# Altium schematic sheet P08_Power Supply Track.SchDoc
size A; SheetNumber: 7; SheetTotal: 8
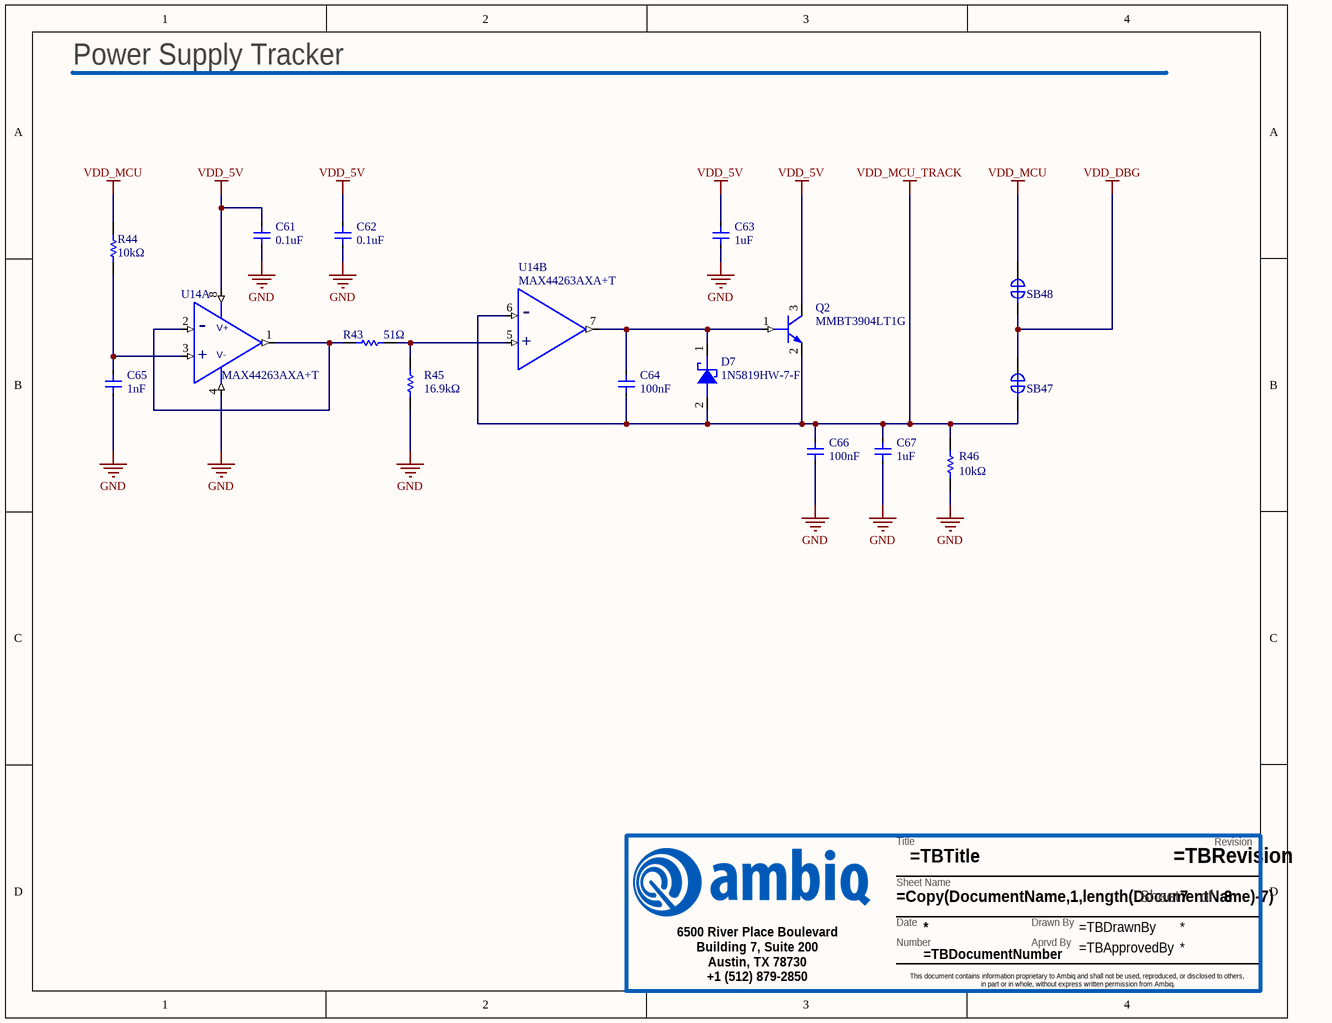
[diagram p0: P08_Power Supply Track.SchDoc]

## Parts
?  TitleBlock  (value not drawn)  (graphical)
C61  0.1uF  [IPC_C]
C62  0.1uF  [IPC_C]
C63  1uF  [IPC_A]
C64  100nF  [IPC_A]
C65  1nF  [IPC_A]
C66  100nF  [IPC_A]
C67  1uF  [IPC_A]
D7  AMBIQ PN: 1N5819HW-7-F  [SOD123_112X67]  (hidden comment: Schottky)
Q2  MMBT3904LT1G  [SOT23-3N]
R43  51Ω  [IPC_A]
R44  10kΩ  [IPC_A]
R45  16.9kΩ  [IPC_A]
R46  10kΩ  [IPC_A]
SB47  Solder short  [SB39X18_SHORTED]  (value not drawn)  (net tie, no BOM)
SB48  Solderbridge  [SB39X18]  (value not drawn)  (no BOM)
U14  MAX44263AXA+T  [SC70_8_2X2MM]  (parts A,B of 2)

## Nets
GND: C61.2 C62.2 C63.2 C65.2 C66.2 C67.2 R45.1 R46.1 U14.4(VSS)
VDD_5V: C61.1 C62.1 C63.1 Q2.3(COLLECTOR) U14.8(VDD)
VDD_DBG: SB47.2 SB48.1
VDD_MCU: R44.1 SB48.2
VDD_MCU_TRACK: C64.2 C66.1 C67.1 D7.2(A) Q2.2(EMITTER) R46.2 SB47.1 U14.6(INB-)
NetC64_1: C64.1 D7.1(C) Q2.1(BASE) U14.7(OUTB)
NetC65_1: C65.1 R44.2 U14.3(INB+)
NetR43_1: R43.1 U14.1(OUTB) U14.2(INB-)
NetR43_2: R43.2 R45.2 U14.5(INB+)

## Notes on the sheet
- Power Supply Tracker
- (in symbol MAX44263AXA+T, part A) V+; +; V-
- (in symbol MAX44263AXA+T, part B) +
- (in symbol TitleBlock) Revision; Title; Sheet Name; Sheet; of; Date; Drawn By; Number; Aprvd By; 6500 River Place Boulevard / Building 7, Suite 200 / Austin, TX 78730 / +1 (512) 879-2850; This document contains information proprietary to Ambiq and shall not be used, reproduced, or disclosed to others, / in part or in whole, without express written permission from Ambiq.

## Library data of the parts
? = TitleBlock: Title block for Ambiq Schematics. Please have the following parameters entered in Project>Project Options>Parameters: / TBTitle / TBDocumentNumber / TBRevision / TBDrawnBy / TBApprovedBy; AMBIQ PN: TitleBlock; DESCRIPTION: Title block for Ambiq Schematics. Please have the following parameters entered in Project>Project Options>Parameters:  TBTitle  TBDocumentNumber  TBRevision  TBDrawnBy  TBApprovedBy
C61 C62 = GRM155R71C104KA88D: NONE; Manufacturer: Murata; Capacitance: 100nF; Tolerance: 10%; Voltage Rating: 16V; Dielectric: X7R; Dielectric Material: Ceramic; Insulation Resistance: 10GR; AMBIQ PN: GRM155R71C104KA88D; Supplier 1: Arrow Electronics; Supplier Part Number 1: GRM155R71C104KA88D; Manufacturer Part Number: GRM155R71C104KA88D; RoHS: Yes; Category: Ceramic Capacitors; Stock 1: 20200000; Pricing 1: 10000=0.00270, 30000=0.00220, 250000=0.00210 (USD); Mount: Surface Mount; Case/Package: 0402; Case Code (Metric): 1005; Case Code (Imperial): 0402; Min Operating Temperature: -55°C; Max Operating Temperature: 125°C; Packaging: Tape and Reel; Voltage: 16V; Voltage Rating (DC): 16V; Length: 1mm; Width: 0.5mm; Height: 0.5mm; Thickness: 0.022inch; Depth: 0.5mm; Radiation Hardening: No; REACH SVHC: No SVHC; Lead Free: Lead Free; RoHS Compliant: Yes; ComponentLink1URL: https://datasheet.ciiva.com/129/grm155r71c104ka88-01-129739.pdf?src-supplier=Digi-Key; ComponentLink1Description: https://datasheet.ciiva.com/129/grm155r71c104ka88-01-129739.pdf?src-supplier=Digi-Key; Package Quantity: 1; Termination: SMD/SMT; Number of Pins: 2; Material: Ceramic; ComponentLink2URL: https://datasheet.ciiva.com/129/grm155r71c104ka88-01-129740.pdf?src-supplier=Digi-Key; ComponentLink2Description: https://datasheet.ciiva.com/129/grm155r71c104ka88-01-129740.pdf?src-supplier=Digi-Key; ComponentLink3URL: https://datasheet.ciiva.com/18102/getdatasheetpartid-85307-18102905.pdf?src-supplier=Verical; ComponentLink3Description: https://datasheet.ciiva.com/18102/getdatasheetpartid-85307-18102905.pdf?src-supplier=Verical
C63 C67 = GRM033R61A105ME15D: NONE; Manufacturer: Murata; Tolerance: 20%; Voltage Rating: 10V; Dielectric: X5R; AMBIQ PN: GRM033R61A105ME15D; Supplier 1: Arrow Electronics; Supplier Part Number 1: GRM033R61A105ME15D; Manufacturer Part Number: GRM033R61A105ME15D; RoHS: Yes; Category: Ceramic Capacitors; Stock 1: 387591; Pricing 1: 1=0.35440, 10=0.26860, 25=0.26600, 50=0.24050, 100=0.18220, 250=0.18020, 500=0.17800, 1000=0.12040, 3000=0.11920, 6000=0.08160,; Mount: Surface Mount; Case/Package: 0201; Case Code (Metric): 0603; Case Code (Imperial): 0201; Min Operating Temperature: -55°C; Max Operating Temperature: 85°C; Capacitance: 1uF; Packaging: Tape and Reel; Voltage Rating (DC): 10V; Length: 0.024inch; Width: 0.012inch; Thickness: 0.015inch; RoHS Compliant: Yes; ComponentLink1URL: http://search.murata.co.jp/Ceramy/image/img/A01X/G101/ENG/GRM033R61A105ME15-01.pdf?src-supplier=Digi-Key; ComponentLink1Description: http://search.murata.co.jp/Ceramy/image/img/A01X/G101/ENG/GRM033R61A105ME15-01.pdf?src-supplier=Digi-Key
C64 C66 = 0201ZD104KAT2A: NONE; Manufacturer: Kyocera AVX; Tolerance: 10%; Voltage Rating: 10V; AMBIQ PN: 0201ZD104KAT2A; Supplier 1: Arrow Electronics; Supplier Part Number 1: 0201ZD104KAT2A; Manufacturer Part Number: 0201ZD104KAT2A; RoHS: Yes; Category: Ceramic Capacitors; Stock 1: 105000; Pricing 1: 15000=0.00770, 30000=0.00750, 45000=0.00740, 60000=0.00720, 75000=0.00690, 150000=0.00620 (USD); Mount: Surface Mount; Case/Package: 0201; Case Code (Metric): 0603; Case Code (Imperial): 0201; Min Operating Temperature: -55°C; Max Operating Temperature: 85°C; Capacitance: 100nF; Packaging: Tape and Reel; Voltage Rating (DC): 10V; Series: -; Lead Free: Lead Free; RoHS Compliant: Yes; ComponentLink1URL: http://www.mouser.com/ds/2/40/cx5r-776519.pdf?src-supplier=Mouser; ComponentLink1Description: http://www.mouser.com/ds/2/40/cx5r-776519.pdf?src-supplier=Mouser
C65 = GRM1555C1H102JA01D: NONE; Manufacturer: Murata; Tolerance: 5%; Voltage Rating: 50V; Dielectric: C0G; Dielectric Material: Ceramic; Insulation Resistance: 10GR; Temperature Coefficient: 30ppm/°C; AMBIQ PN: GRM1555C1H102JA01D; Supplier 1: Arrow Electronics; Supplier Part Number 1: GRM1555C1H102JA01D; Manufacturer Part Number: GRM1555C1H102JA01D; RoHS: Yes; Category: Ceramic Capacitors; Stock 1: 3380000; Pricing 1: 10000=0.00710, 20000=0.00680, 30000=0.00660, 50000=0.00590, 100000=0.00470 (USD); Mount: Surface Mount; Case/Package: 0402; Case Code (Metric): 1005; Case Code (Imperial): 0402; Min Operating Temperature: -55°C; Max Operating Temperature: 125°C; Capacitance: 1nF; Packaging: Tape and Reel; Voltage: 50V; Voltage Rating (DC): 50V; Series: GRM; Construction: Flat; Length: 1mm; Width: 0.5mm; Height: 0.5mm; Thickness: 0.022inch; Depth: 0.5mm; Radiation Hardening: No; REACH SVHC: No SVHC; Lead Free: Lead Free; RoHS Compliant: Yes; ComponentLink1URL: https://datasheet.ciiva.com/34302/1855908-34302849.pdf?src-supplier=Jameco; ComponentLink1Description: https://datasheet.ciiva.com/34302/1855908-34302849.pdf?src-supplier=Jameco; Package Quantity: 1; Termination: SMD/SMT; Number of Pins: 2; Material: Ceramic; Size: 0.5mm
D7 = 1N5819HW-7-F: None; Manufacturer: Diodes; Forward Current: 1A; Max Repetitive Reverse Voltage (Vrrm): 40V; Forward Voltage: 450mV; Max Reverse Current: 50uA; Element Configuration: Single; Max Forward Surge Current (Ifsm): 25A; Max Power Dissipation: 450mW; Polarity: Standard; Capacitance: 110pF; Supplier 1: RSComponents; Supplier Part Number 1: 7082197; Manufacturer Part Number: 1N5819HW-7-F; RoHS: Yes; Category: Schottky Diodes; Stock 1: 100; Pricing 1: 25=0.32800, 150=0.18600, 750=0.12400, 1500=0.09400 (GBP); Case/Package: SOD-123-2; Number of Pins: 2; Weight: 0.000353oz; Contact Plating: Tin,Matte; Min Operating Temperature: -65°C; Max Operating Temperature: 125°C; Packaging: Tape and Reel; Peak Non-Repetitive Surge Current: 25A; Package Quantity: 3000; Average Rectified Current: 1A; Termination: SMD/SMT; Voltage Rating (DC): 40V; Current Rating: 1A; Output Current: 1A; Max Reverse Voltage (DC): 40V; Series: -; Length: 2.85mm; Width: 1.7mm; Height: 1.25mm; Radiation Hardening: No; RoHS Compliant: Yes; REACH SVHC: No SVHC; Lead Free: Lead Free; ComponentLink1URL: https://datasheet.ciiva.com/27092/1538419-27092484.pdf?src-supplier=Jameco; ComponentLink1Description: https://datasheet.ciiva.com/27092/1538419-27092484.pdf?src-supplier=Jameco
Q2 = MMBT3904LT1G: None; Manufacturer: ON Semiconductor; Element Configuration: Single; Max Power Dissipation: 300mW; Polarity: NPN; Voltage Rating (DC): 40V; Current Rating: 200mA; Number of Elements: 1; Frequency: 300MHz; hFE Min: 100; Collector Base Voltage (VCBO): 60V; Emitter Base Voltage (VEBO): 6V; Collector Emitter Saturation Voltage: 300mV; Type: General Purpose; AMBIQ PN: MMBT3904LT1G; Supplier 1: RSComponents; Supplier Part Number 1: 5450343; Manufacturer Part Number: MMBT3904LT1G; RoHS: Yes; Category: BJTs; Stock 1: 150; Pricing 1: 50=0.12200, 100=0.09200, 250=0.09100, 500=0.09000, 1250=0.07100 (GBP); Case/Package: SOT-23-3; Number of Pins: 3; Contact Plating: Tin,Matte; Min Operating Temperature: -55°C; Max Operating Temperature: 150°C; Packaging: Tape and Reel; Package Quantity: 1; Series: -; Length: 2.9mm; Width: 1.3mm; Height: 0.94mm; Radiation Hardening: No; RoHS Compliant: Yes; REACH SVHC: No SVHC; Lead Free: Lead Free; ComponentLink1URL: https://datasheet.ciiva.com/4723/mmbt3904lt1-d-113169-4723050.pdf; ComponentLink1Description: https://datasheet.ciiva.com/4723/mmbt3904lt1-d-113169-4723050.pdf; Collector Emitter Voltage (VCEO): 40V; Max Collector Current: 200mA; Transition Frequency: 300MHz; Collector Emitter Breakdown Voltage: 40V; Max Breakdown Voltage: 40V; Power Dissipation: 300mW; Gain Bandwidth Product: 300MHz; Max Frequency: 300MHz; Collector-emitter Voltage-Max: 300mV
R43 = CRCW040251R0FKED: Res Thick Film 0402 51 Ohm 1% 1/16W ±100ppm/°C Molded SMD SMD Paper T/R; Manufacturer: Vishay; Resistance: 51R; Power Rating: 63mW; Voltage Rating: 50V; AMBIQ PN: CRCW040251R0FKED; Supplier 1: RSComponents; Supplier Part Number 1: 6789425P; Manufacturer Part Number: CRCW040251R0FKED; RoHS: Yes; Category: Chip SMD Resistors; Stock 1: 1; Pricing 1: 50=0.06300, 500=0.05800, 1000=0.05200, 2000=0.04700, 4000=0.04000 (USD); Case/Package: 0402; Weight: 2.3E-05oz; Case Code (Metric): 1005; Case Code (Imperial): 0402; Contact Plating: Tin; Size Code: 0402; Min Operating Temperature: -55°C; Max Operating Temperature: 155°C; Package Quantity: 10; Packaging: Tape and Reel; Resistor Type: Thick Film; Number of Terminations: 2; Termination: SMD/SMT; Max Power Dissipation: 63mW; Temperature Coefficient: 100ppm/°C; Voltage Rating (DC): 50V; Features: Automotive AEC-Q200; Series: CRCW; Technology: THICK FILM; Construction: Rectangular; Length: 1mm; Width: 0.5mm; Height: 0.35mm; Depth: 0.5mm; Radiation Hardening: No; REACH SVHC: Unknown; Military Standard: Not; Lead Free: Lead Free; RoHS Compliant: Yes; ComponentLink1URL: https://datasheet.ciiva.com/11811/0900766b80d98824-11811263.pdf?src-supplier=RSComponents; ComponentLink1Description: https://datasheet.ciiva.com/11811/0900766b80d98824-11811263.pdf?src-supplier=RSComponents; ComponentLink2URL: https://datasheet.ciiva.com/2463/dcrcwe3-2463385.pdf?src-supplier=Digi-Key; ComponentLink2Description: https://datasheet.ciiva.com/2463/dcrcwe3-2463385.pdf?src-supplier=Digi-Key; ComponentLink3URL: https://datasheet.ciiva.com/2463/dcrcwe3-2463386.pdf?src-supplier=Digi-Key; Tolerance: 1%; Number of Pins: 2; Resistance Tolerance: 1%; ComponentLink3Description: https://datasheet.ciiva.com/2463/dcrcwe3-2463386.p; ComponentLink4URL: https://datasheet.ciiva.com/2463/dcrcwe3-2463387.p; ComponentLink4Description: https://datasheet.ciiva.com/2463/dcrcwe3-2463387.p; ComponentLink5URL: https://datasheet.ciiva.com/3256/dcrcwe3-3256623.p; ComponentLink5Description: https://datasheet.ciiva.com/3256/dcrcwe3-3256623.p; ComponentLink6URL: https://datasheet.ciiva.com/16780/70201119-1678071; ComponentLink6Description: https://datasheet.ciiva.com/16780/70201119-1678071; ComponentLink7URL: https://datasheet.ciiva.com/22705/1697337-22705164; ComponentLink7Description: https://datasheet.ciiva.com/22705/1697337-22705164; ComponentLink8URL: https://datasheet.ciiva.com/22870/70201119-2287065; ComponentLink8Description: https://datasheet.ciiva.com/22870/70201119-2287065; ComponentLink9URL: https://datasheet.ciiva.com/7690/1697337-7690680.p; ComponentLink9Description: https://datasheet.ciiva.com/7690/1697337-7690680.p; ComponentLink10URL: https://datasheet.ciiva.com/7690/1697337-7690681.p; ComponentLink10Description: https://datasheet.ciiva.com/7690/1697337-7690681.p
R44 R46 = RC0402FR-0710KL: Surface Mount Thick Film Resistor, Rc Series, 10 Kohm, 62.5 Mw, - 1%, 50 V, 0402 [1005 Metric]; Manufacturer: Yageo; Resistance: 10kR; Power Rating: 62.5mW; Voltage Rating: 50V; Max Power Dissipation: 63mW; Temperature Coefficient: 100ppm/°C; AMBIQ PN: RC0402FR-0710KL; Supplier 1: Arrow Electronics; Supplier Part Number 1: RC0402FR-0710KL; Manufacturer Part Number: RC0402FR-0710KL; RoHS: Yes; Category: Chip SMD Resistors; Stock 1: 7776428; Pricing 1: 10000=0.00210 (USD); Case/Package: 0402; Case Code (Metric): 1005; Case Code (Imperial): 0402; Min Operating Temperature: -55°C; Max Operating Temperature: 155°C; Packaging: Tape and Reel; Resistor Type: Thick Film; Number of Terminations: 2; Termination: SMD/SMT; Voltage Rating (DC): 50V; Features: Moisture Resistant; Series: RC; Construction: Rectangular; Length: 1mm; Width: 0.5mm; Height: 0.32mm; Depth: 0.5mm; REACH SVHC: No SVHC; Military Standard: Not; Lead Free: Lead Free; RoHS Compliant: Yes; ComponentLink1URL: https://datasheet.ciiva.com/7660/38568-7660787.pdf?src-supplier=Element14; ComponentLink1Description: https://datasheet.ciiva.com/7660/38568-7660787.pdf?src-supplier=Element14; ComponentLink2URL: https://datasheet.ciiva.com/7849/1686128-7849814.pdf?src-supplier=Element14; ComponentLink2Description: https://datasheet.ciiva.com/7849/1686128-7849814.pdf?src-supplier=Element14; ComponentLink3URL: https://datasheet.ciiva.com/7983/1018594-7983486.pdf?src-supplier=Element14; Tolerance: 1%; Number of Pins: 2; Resistance Tolerance: 1%; Working Voltage: 50V; Lead Pitch: 0.2mm
R45 = ERJ-2RKF1692X: Res Thick Film 0402 16.9K Ohm 1% 1/10W ±100ppm/°C Molded SMD Punched Carrier T/R; Manufacturer: Panasonic; Resistance: 16.9kR; Power Rating: 100mW; Voltage Rating: 50V; AMBIQ PN: ERJ-2RKF1692X; Supplier 1: Arrow Electronics; Supplier Part Number 1: ERJ-2RKF1692X; Manufacturer Part Number: ERJ-2RKF1692X; RoHS: Yes; Category: Chip SMD Resistors; Stock 1: 49794; Pricing 1: 1=0.06510, 10=0.02940, 25=0.01530, 100=0.00800, 500=0.00790, 1000=0.00470, 3000=0.00380, 6000=0.00350, 15000=0.00270 (USD); Mount: Surface Mount; Case/Package: 0402; Weight: 2.8E-05oz; Case Code (Metric): 1005; Case Code (Imperial): 0402; Contact Plating: Tin; Min Operating Temperature: -55°C; Max Operating Temperature: 155°C; Package Quantity: 1; Packaging: Tape and Reel; Resistor Type: Thick Film; Number of Terminations: 2; Termination: SMD/SMT; Max Power Dissipation: 100mW; Temperature Coefficient: 100ppm/°C; Voltage Rating (DC): 50V; Features: Automotive AEC-Q200; Series: ERJ; Construction: Rectangular; Length: 1mm; Width: 0.02inch; Height: 0.016inch; Depth: 0.5mm; REACH SVHC: Unknown; Military Standard: Not; Lead Free: Lead Free; RoHS Compliant: Yes; ComponentLink1URL: https://datasheet.ciiva.com/7829/1678782-7829302.pdf?src-supplier=Element14; ComponentLink1Description: https://datasheet.ciiva.com/7829/1678782-7829302.pdf?src-supplier=Element14; ComponentLink2URL: https://datasheet.ciiva.com/22773/1678782-22773610.pdf?src-supplier=Farnell; ComponentLink2Description: https://datasheet.ciiva.com/22773/1678782-22773610.pdf?src-supplier=Farnell; ComponentLink3URL: https://datasheet.ciiva.com/22668/1678782-22668622.pdf?src-supplier=Element14; Tolerance: 1%; Resistance Tolerance: 1%; ComponentLink3Description: https://datasheet.ciiva.com/22668/1678782-22668622; ComponentLink4URL: https://datasheet.ciiva.com/22668/1678782-22668621; ComponentLink4Description: https://datasheet.ciiva.com/22668/1678782-22668621; ComponentLink5URL: https://datasheet.ciiva.com/28548/1694929-28548252; ComponentLink5Description: https://datasheet.ciiva.com/28548/1694929-28548252; ComponentLink6URL: https://datasheet.ciiva.com/46420/1678782-46420069; ComponentLink6Description: https://datasheet.ciiva.com/46420/1678782-46420069; ComponentLink7URL: https://datasheet.ciiva.com/16772/70260748-1677257; ComponentLink7Description: https://datasheet.ciiva.com/16772/70260748-1677257; ComponentLink8URL: https://datasheet.ciiva.com/16785/70260748-1678529; ComponentLink8Description: https://datasheet.ciiva.com/16785/70260748-1678529; ComponentLink9URL: https://datasheet.ciiva.com/9192/aoa0000ce2-919261; ComponentLink9Description: https://datasheet.ciiva.com/9192/aoa0000ce2-919261; ComponentLink10URL: https://datasheet.ciiva.com/30252/aoa0000ce2-30252; ComponentLink10Description: https://datasheet.ciiva.com/30252/aoa0000ce2-30252
SB47 = SBS: None; AMBIQ PN: SBS
SB48 = SBO: None; AMBIQ PN: SBO
U14 = MAX44263AXA+T: None; Manufacturer: Maxim; Max Supply Voltage: 5.5V; Min Supply Voltage: 1.8V; Bandwidth: 15MHz; Nominal Supply Current: 1uA; Operating Supply Current: 650uA; Number of Channels: 2; Input Bias Current: 0.01pA; Common Mode Rejection Ratio: 75dB; Slew Rate: 7V/µs; Voltage Gain: 115dB; Input Offset Voltage (Vos): 10uV; Output Current per Channel: 50mA; Amplifier Type: GENERAL PURPOSE; AMBIQ PN: MAX44263AXA+T; Manufacturer Part Number: MAX44263AXA+T; Supplier 1: Future Electronics; Supplier Part Number 1: 6085643; RoHS: Yes; Category: Amplifiers - Op Amps, Buffer, Instrumentation; Stock 1: 2500; Pricing 1: 2500=1.52000, 5000=1.49000 (USD); Case/Package: SC; Number of Pins: 8; Min Operating Temperature: -40°C; Max Operating Temperature: 125°C; Package Quantity: 2500; Packaging: Tape and Reel; Supply Current: 1uA; Series: -; REACH SVHC: Unknown; RoHS Compliant: Yes; ComponentLink1URL: https://datasheet.ciiva.com/14084/max44260-max44263-14084824.pdf?src-supplier=Digi-Key; ComponentLink1Description: https://datasheet.ciiva.com/14084/max44260-max44263-14084824.pdf?src-supplier=Digi-Key; Mount: Surface Mount; Gain Bandwidth Product: 15MHz; Number of Circuits: 2; Number of Amplifiers: 2; Technology: CMOS